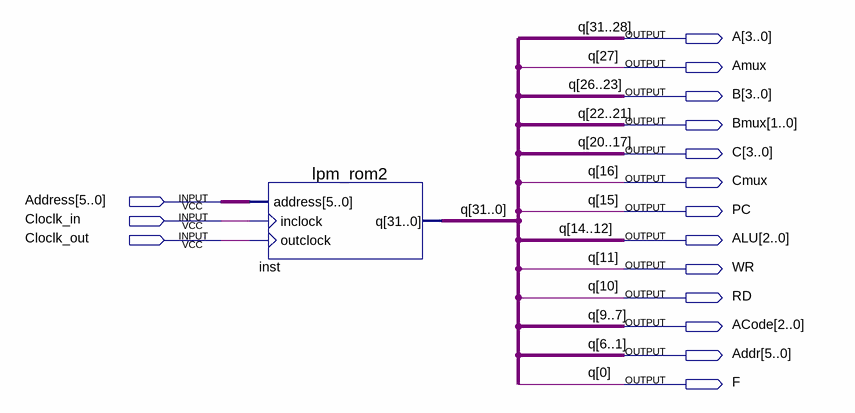
[diagram p0: schematic sheet]
// Quartus schematic rom.bdf as structural Verilog: 1 symbols, 16 pins
module rom (
  input  [5:0] Address,
  input  Cloclk_in,
  input  Cloclk_out,
  output [3:0] A,
  output Amux,
  output [3:0] B,
  output [1:0] Bmux,
  output [3:0] C,
  output Cmux,
  output PC,
  output [2:0] ALU,
  output WR,
  output RD,
  output [2:0] ACode,
  output [5:0] Addr,
  output F
);

  lpm_rom2 inst (
    .address(Address), .inclock(Cloclk_in), .outclock(Cloclk_out),
    .q({A, Amux, B, Bmux, C, Cmux, PC, ALU, WR, RD, ACode, Addr, F}));

  // Other names for the same wires on the sheet: q[31:0] = {A, Amux, B, Bmux, C, Cmux, PC, ALU, WR, RD, ACode, Addr, F}
endmodule
